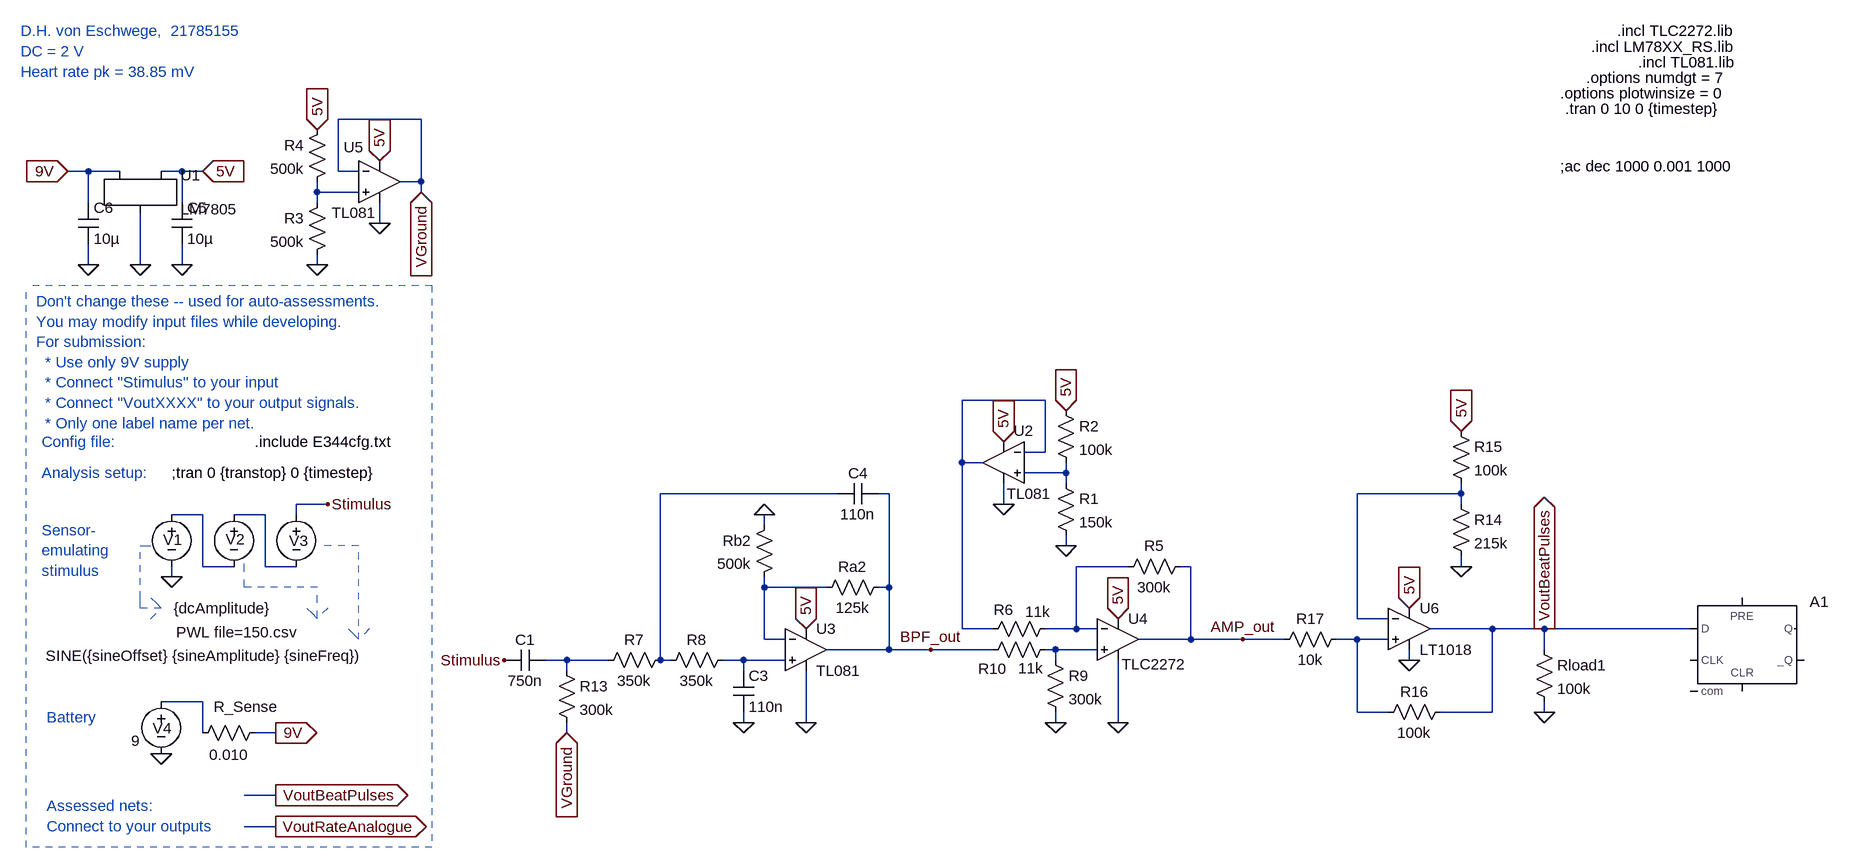
[diagram p0: schematic X_2ndOrderBPF_Schmitt - DAC.asc]
X_2ndOrderBPF_Schmitt - DAC.asc, the LTspice schematic file:
Version 4
SHEET 1 1824 680
WIRE -1696 -1664 -1824 -1664
WIRE -2208 -1584 -2240 -1584
WIRE -2160 -1584 -2208 -1584
WIRE -2064 -1584 -2096 -1584
WIRE -2032 -1584 -2064 -1584
WIRE -1824 -1584 -1824 -1664
WIRE -1792 -1584 -1824 -1584
WIRE -1696 -1568 -1696 -1664
WIRE -1696 -1568 -1728 -1568
WIRE -1856 -1552 -1856 -1568
WIRE -1792 -1552 -1856 -1552
WIRE -1696 -1552 -1696 -1568
WIRE -2208 -1536 -2208 -1584
WIRE -2064 -1536 -2064 -1584
WIRE -1856 -1536 -1856 -1552
WIRE -1760 -1504 -1760 -1536
WIRE -2208 -1440 -2208 -1472
WIRE -2128 -1440 -2128 -1520
WIRE -2064 -1440 -2064 -1472
WIRE -1856 -1440 -1856 -1456
WIRE -736 -1232 -864 -1232
WIRE -736 -1152 -736 -1232
WIRE -736 -1152 -768 -1152
WIRE -864 -1136 -864 -1232
WIRE -832 -1136 -864 -1136
WIRE -704 -1120 -704 -1136
WIRE -704 -1120 -768 -1120
WIRE -704 -1104 -704 -1120
WIRE -1056 -1088 -1328 -1088
WIRE -976 -1088 -992 -1088
WIRE -96 -1088 -96 -1104
WIRE -96 -1088 -256 -1088
WIRE -1840 -1072 -1888 -1072
WIRE -800 -1072 -800 -1104
WIRE -96 -1072 -96 -1088
WIRE -2032 -1056 -2080 -1056
WIRE -1936 -1056 -1984 -1056
WIRE -1888 -1056 -1888 -1072
WIRE -1168 -1040 -1168 -1056
WIRE -704 -1008 -704 -1024
WIRE -2032 -976 -2032 -1056
WIRE -1984 -976 -2032 -976
WIRE -1936 -976 -1936 -1056
WIRE -1888 -976 -1936 -976
WIRE -608 -976 -688 -976
WIRE -512 -976 -528 -976
WIRE -96 -976 -96 -992
WIRE -2080 -960 -2080 -976
WIRE -1168 -944 -1168 -960
WIRE -1072 -944 -1168 -944
WIRE -976 -944 -976 -1088
WIRE -976 -944 -992 -944
WIRE -256 -896 -256 -1088
WIRE -208 -896 -256 -896
WIRE -864 -880 -864 -1136
WIRE -816 -880 -864 -880
WIRE -688 -880 -688 -976
WIRE -688 -880 -736 -880
WIRE -656 -880 -688 -880
WIRE -48 -880 -144 -880
WIRE 32 -880 -48 -880
WIRE 256 -880 32 -880
WIRE -1168 -864 -1168 -944
WIRE -1136 -864 -1168 -864
WIRE -512 -864 -512 -976
WIRE -512 -864 -592 -864
WIRE -432 -864 -512 -864
WIRE -368 -864 -432 -864
WIRE -256 -864 -288 -864
WIRE -208 -864 -256 -864
WIRE -976 -848 -976 -944
WIRE -976 -848 -1072 -848
WIRE -912 -848 -976 -848
WIRE -816 -848 -912 -848
WIRE -720 -848 -736 -848
WIRE -656 -848 -720 -848
WIRE 32 -848 32 -880
WIRE -1472 -832 -1504 -832
WIRE -1408 -832 -1472 -832
WIRE -1328 -832 -1328 -1088
WIRE -1312 -832 -1328 -832
WIRE -1200 -832 -1232 -832
WIRE -1136 -832 -1200 -832
WIRE -720 -832 -720 -848
WIRE -176 -832 -176 -848
WIRE -1472 -816 -1472 -832
WIRE -1200 -816 -1200 -832
WIRE -2032 -768 -2096 -768
WIRE -256 -752 -256 -864
WIRE -208 -752 -256 -752
WIRE -48 -752 -48 -880
WIRE -48 -752 -128 -752
WIRE 32 -752 32 -768
WIRE -1200 -736 -1200 -752
WIRE -1104 -736 -1104 -816
WIRE -720 -736 -720 -752
WIRE -624 -736 -624 -832
WIRE -2032 -720 -2032 -768
WIRE -1920 -720 -1952 -720
WIRE -1472 -720 -1472 -736
WIRE -1920 -624 -1968 -624
WIRE -1920 -576 -1968 -576
FLAG -2080 -960 0
FLAG -1840 -1072 Stimulus
FLAG -1920 -720 9V
IOPIN -1920 -720 Out
FLAG -2096 -688 0
FLAG -1920 -624 VoutBeatPulses
IOPIN -1920 -624 Out
FLAG -1920 -576 VoutRateAnalogue
IOPIN -1920 -576 Out
FLAG -2128 -1440 0
FLAG -1104 -736 0
FLAG -1200 -736 0
FLAG -1168 -1056 0
FLAG -2240 -1584 9V
IOPIN -2240 -1584 In
FLAG -2208 -1440 0
FLAG -2064 -1440 0
FLAG -2032 -1584 5V
IOPIN -2032 -1584 In
FLAG -1104 -880 5V
IOPIN -1104 -880 In
FLAG 32 -752 0
FLAG -624 -736 0
FLAG -720 -736 0
FLAG -912 -848 BPF_out
FLAG -704 -1008 0
FLAG -704 -1216 5V
IOPIN -704 -1216 In
FLAG -800 -1072 0
FLAG -624 -896 5V
IOPIN -624 -896 In
FLAG 32 -880 VoutBeatPulses
IOPIN 32 -880 Out
FLAG -176 -912 5V
IOPIN -176 -912 In
FLAG -176 -832 0
FLAG -1856 -1440 0
FLAG -1856 -1648 5V
IOPIN -1856 -1648 In
FLAG -1760 -1504 0
FLAG -1760 -1600 5V
IOPIN -1760 -1600 In
FLAG -1568 -832 Stimulus
FLAG -432 -864 AMP_out
FLAG -96 -976 0
FLAG -96 -1184 5V
IOPIN -96 -1184 In
FLAG -1696 -1552 VGround
IOPIN -1696 -1552 In
FLAG -1472 -720 VGround
IOPIN -1472 -720 In
FLAG -800 -1168 5V
IOPIN -800 -1168 In
SYMBOL voltage -1984 -1072 R0
WINDOW 123 0 0 Left 0
WINDOW 39 0 0 Left 0
WINDOW 3 -89 197 Left 2
WINDOW 0 -13 54 Left 2
SYMATTR Value PWL file=150.csv
SYMATTR InstName V2
SYMBOL voltage -1888 -1072 R0
WINDOW 123 24 44 Left 2
WINDOW 39 0 0 Left 0
WINDOW 3 -386 233 Left 2
WINDOW 0 -11 56 Left 2
SYMATTR Value SINE({sineOffset} {sineAmplitude} {sineFreq})
SYMATTR InstName V3
SYMBOL voltage -2080 -1072 R0
WINDOW 123 0 0 Left 0
WINDOW 39 0 0 Left 0
WINDOW 3 3 160 Left 2
WINDOW 0 -13 55 Left 2
SYMATTR Value {dcAmplitude}
SYMATTR InstName V1
SYMBOL voltage -2096 -784 R0
WINDOW 123 24 44 Left 2
WINDOW 39 0 0 Left 0
WINDOW 3 -46 76 Left 2
WINDOW 0 -13 57 Left 2
SYMATTR Value 9
SYMATTR InstName V4
SYMBOL res -1936 -736 R90
WINDOW 0 -9 30 VBottom 2
WINDOW 3 34 56 VTop 2
SYMATTR InstName R_Sense
SYMATTR Value 0.010
SYMBOL LM7805 -2128 -1568 R0
SYMATTR InstName U1
SYMBOL res -1312 -848 R90
WINDOW 0 0 56 VBottom 2
WINDOW 3 32 56 VTop 2
SYMATTR InstName R7
SYMATTR Value 350k
SYMBOL cap -1216 -816 R0
SYMATTR InstName C3
SYMATTR Value 110n
SYMBOL Opamps\\opamp2 -1104 -912 R0
SYMATTR InstName U3
SYMATTR Value TL081
SYMBOL res -1216 -848 R90
WINDOW 0 0 56 VBottom 2
WINDOW 3 32 56 VTop 2
SYMATTR InstName R8
SYMATTR Value 350k
SYMBOL res -976 -960 R90
WINDOW 0 0 56 VBottom 2
WINDOW 3 32 56 VTop 2
SYMATTR InstName Ra2
SYMATTR Value 125k
SYMBOL res -1152 -1056 M0
SYMATTR InstName Rb2
SYMATTR Value 500k
SYMBOL cap -992 -1104 R90
WINDOW 0 0 32 VBottom 2
WINDOW 3 32 32 VTop 2
SYMATTR InstName C4
SYMATTR Value 110n
SYMBOL cap -2080 -1536 R0
SYMATTR InstName C5
SYMATTR Value 10µ
SYMBOL cap -2224 -1536 R0
SYMATTR InstName C6
SYMATTR Value 10µ
SYMBOL res 16 -864 R0
SYMATTR InstName Rload1
SYMATTR Value 100k
SYMBOL res -512 -992 R90
WINDOW 0 0 56 VBottom 2
WINDOW 3 32 56 VTop 2
SYMATTR InstName R5
SYMATTR Value 300k
SYMBOL res -720 -896 R90
WINDOW 0 2 80 VBottom 2
WINDOW 3 -26 27 VTop 2
SYMATTR InstName R6
SYMATTR Value 11k
SYMBOL Opamps\\opamp2 -624 -928 R0
WINDOW 3 6 102 Left 2
SYMATTR Value TLC2272
SYMATTR InstName U4
SYMBOL res -736 -848 R0
SYMATTR InstName R9
SYMATTR Value 300k
SYMBOL res -720 -864 R90
WINDOW 0 61 97 VBottom 2
WINDOW 3 29 38 VTop 2
SYMATTR InstName R10
SYMATTR Value 11k
SYMBOL res -720 -1120 R0
SYMATTR InstName R1
SYMATTR Value 150k
SYMBOL res -720 -1232 R0
SYMATTR InstName R2
SYMATTR Value 100k
SYMBOL Opamps\\opamp2 -800 -1200 M0
WINDOW 0 -46 15 Left 2
WINDOW 3 -74 112 Left 2
SYMATTR InstName U2
SYMATTR Value TL081
SYMBOL Comparators\\LT1018 -176 -880 R0
SYMATTR InstName U6
SYMBOL cap -1504 -816 M270
WINDOW 0 32 32 VTop 2
WINDOW 3 0 32 VBottom 2
SYMATTR InstName C1
SYMATTR Value 750n
SYMBOL res -1840 -1552 M0
SYMATTR InstName R3
SYMATTR Value 500k
SYMBOL res -1840 -1664 M0
SYMATTR InstName R4
SYMATTR Value 500k
SYMBOL Opamps\\opamp2 -1760 -1632 R0
WINDOW 0 -55 11 Left 2
WINDOW 3 -74 112 Left 2
SYMATTR InstName U5
SYMATTR Value TL081
SYMBOL res -1488 -832 R0
SYMATTR InstName R13
SYMATTR Value 300k
SYMBOL res -112 -1088 R0
SYMATTR InstName R14
SYMATTR Value 215k
SYMBOL res -112 -1200 R0
SYMATTR InstName R15
SYMATTR Value 100k
SYMBOL res -112 -768 R90
WINDOW 0 0 56 VBottom 2
WINDOW 3 32 56 VTop 2
SYMATTR InstName R16
SYMATTR Value 100k
SYMBOL res -272 -880 R90
WINDOW 0 0 56 VBottom 2
WINDOW 3 32 56 VTop 2
SYMATTR InstName R17
SYMATTR Value 10k
SYMBOL Digital\\dflop 336 -928 R0
SYMATTR InstName A1
TEXT -2080 -1120 Left 2 !;tran 0 {transtop} 0 {timestep}
TEXT -1952 -1168 Left 2 !.include E344cfg.txt
TEXT -2288 -1384 Left 2 ;Don't change these -- used for auto-assessments.\nYou may modify input files while developing.\nFor submission: \n  * Use only 9V supply \n  * Connect "Stimulus" to your input\n  * Connect "VoutXXXX" to your output signals.\n  * Only one label name per net.
TEXT -2280 -1168 Left 2 ;Config file:
TEXT -2280 -1120 Left 2 ;Analysis setup:
TEXT -2272 -744 Left 2 ;Battery
TEXT -2280 -1032 Left 2 ;Sensor-\nemulating \nstimulus
TEXT -2272 -608 Left 2 ;Assessed nets:\nConnect to your outputs
TEXT -2312 -1800 Left 2 ;D.H. von Eschwege,  21785155\nDC = 2 V\nHeart rate pk = 38.85 mV
TEXT 144 -1800 Left 2 !.incl TLC2272.lib
TEXT 104 -1776 Left 2 !.incl LM78XX_RS.lib
TEXT 176 -1752 Left 2 !.incl TL081.lib
TEXT 96 -1728 Left 2 !.options numdgt = 7
TEXT 56 -1704 Left 2 !.options plotwinsize = 0
TEXT 56 -1592 Left 2 !;ac dec 1000 0.001 1000
TEXT 64 -1680 Left 2 !.tran 0 10 0 {timestep}
LINE Normal -1792 -1008 -1856 -1008 2
LINE Normal -1792 -864 -1792 -1008 2
LINE Normal -1808 -880 -1792 -864 2
LINE Normal -1792 -864 -1808 -880 2
LINE Normal -1776 -880 -1792 -864 2
LINE Normal -2128 -1008 -2112 -1008 2
LINE Normal -2128 -928 -2128 -1008 2
LINE Normal -2128 -912 -2128 -928 2
LINE Normal -2096 -912 -2128 -912 2
LINE Normal -2112 -928 -2096 -912 2
LINE Normal -2096 -912 -2112 -928 2
LINE Normal -2112 -896 -2096 -912 2
LINE Normal -1968 -944 -1968 -992 2
LINE Normal -1856 -944 -1968 -944 2
LINE Normal -1856 -896 -1856 -944 2
LINE Normal -1872 -912 -1856 -896 2
LINE Normal -1856 -896 -1872 -912 2
LINE Normal -1840 -912 -1856 -896 2
LINE Normal -2304 -544 -2304 -1408 1
LINE Normal -1680 -1408 -1680 -544 1
LINE Normal -1680 -544 -2304 -544 1
LINE Normal -1680 -1408 -2304 -1408 1

The netlist it stands for:
* X_2ndOrderBPF_Schmitt - DAC.asc
V2 N007 N006 PWL file=150.csv
V3 Stimulus N007 SINE({sineOffset} {sineAmplitude} {sineFreq})
V1 N006 0 {dcAmplitude}
V4 N014 0 9
R_Sense 9V N014 0.010
XU1 9V 0 5V LM7805
R7 N004 N012 350k
C3 N013 0 110n
XU3 N013 N009 5V 0 BPF_out TL081  ; pins In+ In- V+ V- OUT
R8 N013 N004 350k
Ra2 BPF_out N009 125k
Rb2 0 N009 500k
C4 BPF_out N004 110n
C5 5V 0 10µ
C6 9V 0 10µ
Rload1 VoutBeatPulses 0 100k
R5 AMP_out N008 300k
R6 N008 N002 11k
XU4 N011 N008 5V 0 AMP_out TLC2272  ; pins In+ In- V+ V- OUT
R9 N011 0 300k
R10 N011 BPF_out 11k
R1 N003 0 150k
R2 5V N003 100k
XU2 N003 N002 5V 0 N002 TL081  ; pins In+ In- V+ V- OUT
XU6 N010 N005 5V 0 VoutBeatPulses LT1018  ; pins In+ In- V+ V- OUT
C1 N012 Stimulus 750n
R3 N001 0 500k
R4 5V N001 500k
XU5 N001 VGround 5V 0 VGround TL081  ; pins In+ In- V+ V- OUT
R13 N012 VGround 300k
R14 N005 0 215k
R15 5V N005 100k
R16 VoutBeatPulses N010 100k
R17 N010 AMP_out 10k
A1 VoutBeatPulses 0 0 0 0 0 0 0 DFLOP
;tran 0 {transtop} 0 {timestep}
.include E344cfg.txt
* Don't change these -- used for auto-assessments.
* You may modify input files while developing.
* For submission:
*   * Use only 9V supply
*   * Connect "Stimulus" to your input
*   * Connect "VoutXXXX" to your output signals.
*   * Only one label name per net.
* Config file:
* Analysis setup:
* Battery
* Sensor-
* emulating
* stimulus
* Assessed nets:
* Connect to your outputs
* D.H. von Eschwege,  21785155
* DC = 2 V
* Heart rate pk = 38.85 mV
.incl TLC2272.lib
.incl LM78XX_RS.lib
.incl TL081.lib
.options numdgt = 7
.options plotwinsize = 0
;ac dec 1000 0.001 1000
.tran 0 10 0 {timestep}
.lib LTC1.lib
.backanno
.end